# Altium project PCB_buckconverter_1.0.PrjPcb
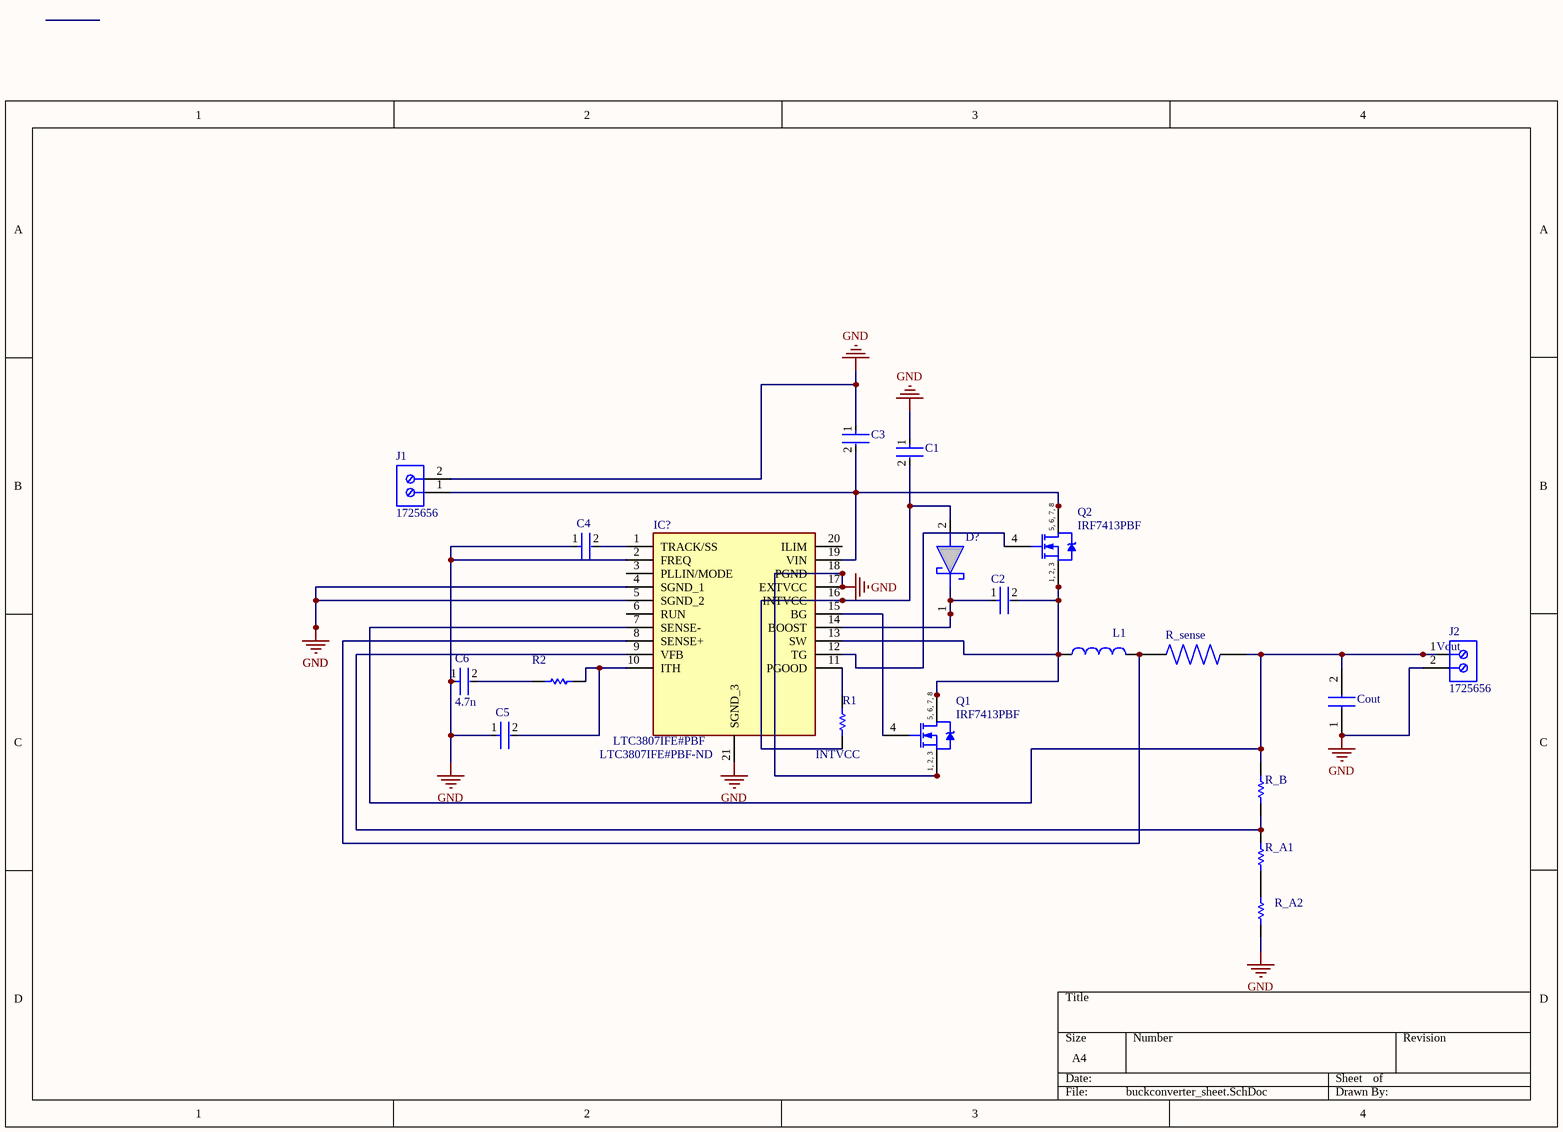
[diagram p0: buckconverter_sheet.SchDoc]
1 sheet, 20 parts. Net scope: global (net labels, ports and power ports of the same name join across sheets).
Board file: PCB1.PcbDoc

## Sheet buckconverter_sheet.SchDoc
size A4; SheetNumber: 1; SheetTotal: 1

### Parts
C1  (no value)  [FP-C0805C-DN-MFG]
C2  (no value)  [FP-C0805C-DN-MFG]
C3  (no value)  [FP-1210-L_3_3_0_4-W_2_5_0-MFG]
C4  (no value)  [FP-C0805C-DN-MFG]
C5  (no value)  [FP-C0805C-DN-MFG]
C6  4.7n  [FP-C0805C-DN-MFG]
Cout  (no value)  [CAPPRD500W60D1000H1400]
D1  (no value)  [SOD2512X110N]
IC1  LTC3807IFE#PBF  Supplier Part Number 1: LTC3807IFE#PBF-ND  [SOP65P640X120-21N]
J1  1725656  [PHOE-1725656-2]
J2  1725656  [PHOE-1725656-2]
L1  Inductor  [MtFootprint]  (value not drawn)
Q1  IRF7413PBF  [INTR-SO-8_V]
Q2  IRF7413PBF  [INTR-SO-8_V]
R1  (no value)  [RESC2013X50X30LL20T20]
R2  (no value)  [RESC2013X50X30LL20T20]
R_A1  (no value)  [RESC2013X50X30LL20T20]
R_A2  (no value)  [RESC2013X50X30LL20T20]
R_B  (no value)  [RESC2013X50X30LL20T20]
R_sense  (no value)  [RESC6432X90N]

### Nets
GND: C1.1 C3.1 C4.1 C5.1 C6.1 Cout.1(+) IC1.2(FREQ) IC1.4(SGND_1) IC1.5(SGND_2) IC1.17(EXTVCC) IC1.18(PGND) IC1.21(SGND_3) J1.2 J2.2 Q1.1(S) Q1.2(S) Q1.3(S) R_A2.1
NetC1_2: C1.2 D1.2(A) IC1.16(INTVCC) R1.1
NetC2_1: C2.1 D1.1(K) IC1.14(BOOST)
NetC2_2: C2.2 IC1.13(SW) L1.1 Q1.5(D) Q1.6(D) Q1.7(D) Q1.8(D) Q2.1(S) Q2.2(S) Q2.3(S)
NetC3_2: C3.2 IC1.19(VIN) J1.1 Q2.5(D) Q2.6(D) Q2.7(D) Q2.8(D)
NetC4_2: C4.2 IC1.1(TRACK/SS)
NetC5_2: C5.2 IC1.10(ITH) R2.2
NetC6_2: C6.2 R2.1
NetCout_2: Cout.2(-) IC1.7(SENSE-) J2.1 R_B.2 R_sense.2
NetIC1_8: IC1.8(SENSE+) L1.2 R_sense.1
NetIC1_9: IC1.9(VFB) R_A1.2 R_B.1
NetIC1_11: IC1.11(PGOOD) R1.2
NetIC1_12: IC1.12(TG) Q2.4(G)
NetIC1_15: IC1.15(BG) Q1.4(G)
NetR_A1_1: R_A1.1 R_A2.2

Not connected (* = marked no-connect by the designer): IC1 3(PLLIN/MODE) 6(RUN) 20(ILIM)

### Notes on the sheet
- (near J2) Vout
- INTVCC
- (in symbol CMP-2000-06466-1) 5, 6, 7, 8; 1, 2, 3

### Library data of the parts
C1 C2 C4-C6 = CMP-1036-01962-2: C0805 100 pF C0G 30ppm/°C 5.00% 50 V; Manufacturer Part Number: C0805C101J5GAC; Manufacturer: KEMET; Value: 100 pF; Material: Ceramic; Voltage Rating: 50 V; Tolerance: 0.05; Temperature Coefficient: 30ppm/°C; Device Class L3: Ceramic Capacitors; Height: 0.88mm; Temperature: -55°C to +125°C; RoHS: TRUE; ComponentLink2URL: https://content.kemet.com/datasheets/KEM_C1003_C0G_SMD.pdf; Device Class L1: Passive Components; Temperature Characteristic: C0G; Temperature Range Low: -55°C; Package: C0805C-DN; Device Class L2: Capacitors; Octopart: https://octopart.com/c0805c101j5gac-kemet-1325415; Capacitance: 100 pF; Automotive: No; ComponentLink2Description: Datasheet; Lead Free: Yes; Mouser Description: Cap Ceramic 100pF 50V C0G 5% Pad SMD 0805 125C Bulk; Temperature Range High: +125°C; Category: Cap; Ipc Land Pattern Name: CAPC200125X78
C3 = CMP-1038-00766-3: General Purpose Ceramic Capacitor, 1210, 2.7nF, 5%, NP0, 30ppm/°C, 50V; Dissipation Factor: 10%; Dielectric: C0G; Packaging: Tape and Reel; Tolerance: 5%; Number of Pins: 2; Construction: Flat; Thickness: 0.037inch; Series: 1210; Package Quantity: 4000; Case Code (Imperial): 1210; Mount: Surface Mount; Voltage Rating (DC): 50V; Length: 3.2mm; Depth: 2.5mm; Case/Package: 1210; RoHS Compliant: Yes; Width: 0.098inch; Min Operating Temperature: -55°C; Radiation Hardening: No; Max Operating Temperature: 125°C; Case Code (Metric): 3225; Voltage Rating: 50V; Termination: SMD/SMT; Capacitance: 2.7nF; Height: 0.33mm
Cout = RR71A221MDN1PH: Capacitor; Manufacturer_Name: Nichicon; Datasheet Link: https://no.mouser.com/datasheet/2/293/e_rr7-1919103.pdf; Height: 14mm; Manufacturer_Part_Number: RR71A221MDN1PH; Mouser Part Number: 647-RR71A221MDN1PH; Mouser Price/Stock: https://www.mouser.co.uk/ProductDetail/Nichicon/RR71A221MDN1PH?qs=JgOBn5pVFoqscRXN9wfnRw%3D%3D
D1 = CMDSH2-3_TR_PBFREE: DIODE SCHOTTKY 30V 200MA SOD323; Manufacturer_Name: Central Semiconductor; Manufacturer_Part_Number: CMDSH2-3 TR PBFREE; Geometry.Height: 1.1mm; Mouser Part Number: 610-CMDSH2-3; Mouser Price/Stock: https://www.mouser.co.uk/ProductDetail/Central-Semiconductor/CMDSH2-3-TR-PBFREE?qs=u16ybLDytRa%2FuaZxWATy%2FQ%3D%3D; Datasheet Link: https://my.centralsemi.com/get_document.php?cmp=1&mergetype=pd&mergepath=pd&pdf_id=CMDSH2-3.PDF
IC1 = LTC3807IFE#PBF: Integrated Circuit; Manufacturer_Name: Analog Devices; Manufacturer 1: Analog Devices / Linear Technology; Number of Outputs: 1; Switching Frequency: 900kHz; Max Duty Cycle: 99%; Synchronous Rectifier: Yes; Min Supply Voltage: 4V; Max Supply Voltage: 38V; Clock Sync: No; Output Configuration: Positive; Datasheet Link: https://www.arrow.com/en/products/ltc3807ifepbf/analog-devices; Height: 1.2mm; Manufacturer_Part_Number: LTC3807IFE#PBF; Supplier 1: Digi-Key; Manufacturer Part Number 1: LTC3807IFE#PBF; Stock 1: 169; Pricing 1: 1=6,91000, 25=4,58840, 100=3,79400 (USD); RoHS: Yes; Case/Package: TSSOP; Number of Pins: 20; Min Operating Temperature: -40°C; Max Operating Temperature: 125°C; Packaging: Rail/Tube; Number of Output Phases: 1; REACH SVHC: No SVHC; ComponentLink1URL: http://www.linear.com/docs/45333?src-supplier=Digi-Key; ComponentLink1Description: http://www.linear.com/docs/45333?src-supplier=Digi-Key; ComponentLink2URL: http://www.farnell.com/datasheets/1852475.pdf?src-supplier=Element14; ComponentLink2Description: http://www.farnell.com/datasheets/1852475.pdf?src-supplier=Element14
J1 J2 = CMP-2000-05299-1: Male Header, Pitch 2.54 mm, 1 x 2 Position, Height 9 mm, Tail Length 3.5 mm; Manufacturer: Phoenix Contact; Number of contacts: 2; Content: 250pc(s); Pitch: 2.54mm; Industrial packaging: Yes; Colour: Green; Manufacturer part No.: 1725656; Type: MPT0,5/2-2,54; Datasheet URL: http://datasheet.octopart.com/1725656-Phoenix-Contact-datasheet-5302866.pdf; Manufacturer URL: http://www.phoenixcontact.com/; Datasheet Version: Apr-08
L1 = Inductor: General Purpose Inductor, 2.5uH, 20%, 1 Element, Ferrite-Core, SMD, 5039; Manufacturer: Bourns; Manufacturer Part Number: SDR1005-2R5ML; SimulationGenericComponent: True; Case/Size Code: 5039; DC Resistance (DCR): 12mR; Inductor Application: POWER INDUCTOR; Channels: 1; Max Current Rating: 5.5A; Self Resonant Frequency: 56MHz; Shape/Size Description: RECTANGULAR PACKAGE; Shielding: Unshielded; Test Frequency: 1kHz; Package Height: 5mm; Package Length: 12.7mm; Package Width: 10mm; Supplier: Digikey; Supplier Part Number: SDR1005-2R5MLCT-ND; RoHS: Yes; Category: Fixed Inductors; Stock: 579; Pricing: 1=0,83, 10=0,714, 25=0,6548, 50=0,5952, 100=0,5297, 250=0,49992 (USD); Pins: 2; Core Material: Ferrite; Terminal Finish: Copper; Min Operating Temperature: -40°C; Max Operating Temperature: 125°C; Tolerance: 20%; JESD-609 Code: e2; Construction: Rectangular; Inductance-Nom (L): 2.5uH; Inductor Type: GENERAL PURPOSE INDUCTOR; Package Style: SMTMeter; Packaging: Tape and Reel; Surface Mount: Yes; Terminal Placement: Dual Ended; Termination: Wraparound; Reach SVHC Compliant: Yes; RoHS Compliant: Yes; ComponentLink1URL: https://datasheet.ciiva.com:443/pdfs/VipMasterIC/IC/BOUR/BOUR-S-A0006604481/BOUR-S-A0006604481-1.pdf?src-supplier=IHS+Markit; ComponentLink1Description: https://datasheet.ciiva.com:443/pdfs/VipMasterIC/IC/BOUR/BOUR-S-A0006604481/BOUR-S-A0006604481-1.pdf?src-supplier=IHS+Markit; ComponentLink2URL: https://datasheet.ciiva.com/8515/sdr1005-8515477.pdf?src-supplier=Avnet; ComponentLink2Description: https://datasheet.ciiva.com/8515/sdr1005-8515477.pdf?src-supplier=Avnet
Q1 Q2 = CMP-2000-06466-1: HEXFET (R) Power MOSFET, 30 V, -55 to 150 degC, 8-Pin SO, RoHS, Tube; Manufacturer: International Rectifier; Rated Power Dissipation: 2.5W; Qg Gate Charge: 52nC; Channel Type: N-Channel; Drain-to-Source Voltage [Vdss]: 30V; Drain-Source On Resistance-Max: 0.011O; Mounting Technology: SurfaceMount; Datasheet URL: http://www.infineon.com/dgdl/irf7413pbf.pdf?fileId=5546d462533600a4015355fa8e901bb8; Package Description: 8-Pin Small Outline Integrated Circuit, Body 4.9 x 3.9 mm, Pitch 1.27 mm; Package Reference: SO-8; Datasheet Version: 02/2008; Manufacturer URL: http://internationalrectifier.com/
R1 R2 R_A1 R_A2 R_B = CMP-2001-04896-1: Manufacturer: Vishay Dale; Part Number: CRCW08050000Z0EA
R_sense = CRE2512-FZ-R008E-3: 8 mOhms Â±1% 3W Chip Resistor 2512 (6432 Metric) Automotive AEC-Q200, Current Sense, Moisture Resistant Metal Element; MF: Bourns; Digi-Key_Part_Number: CRE2512-FZ-R008E-3CT-ND; Check_prices: https://www.snapeda.com/parts/CRE2512-FZ-R008E-3/Bourns/view-part/984047/?ref=eda; Package: 6432 Stackpole; MP: CRE2512-FZ-R008E-3; Value: *; SnapEDA_Link: https://www.snapeda.com/parts/CRE2512-FZ-R008E-3/Bourns/view-part/984047/?ref=snap